# Altium schematic sheet PWR.SchDoc
size A; SheetNumber: 1; SheetTotal: 2
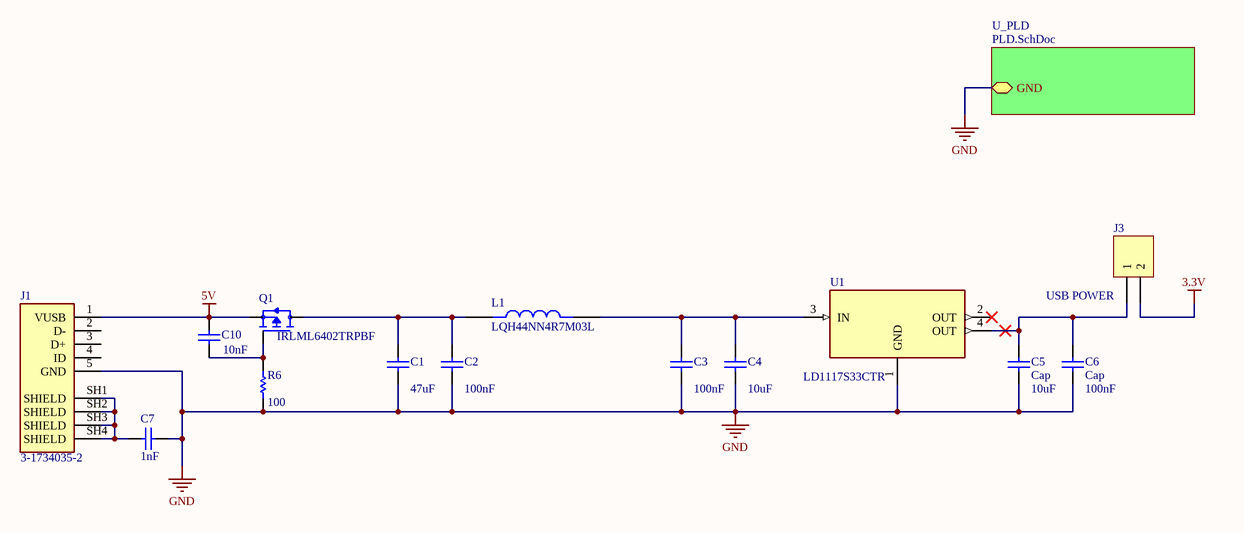
[diagram p0: PWR.SchDoc]

## Parts
C1  value 47uF  [WCAP-CSGP_885012209019]  (hidden comment: Cap)
C2  value 100nF  [WCAP-CSST_885382207009]  (hidden comment: Cap)
C3  value 100nF  [WCAP-CSST_885382207009]  (hidden comment: Cap)
C4  value 10uF  [WCAP-CSST_885382207009]  (hidden comment: Cap)
C5  Cap  value 10uF  [WCAP-CSST_885382207009]
C6  Cap  value 100nF  [WCAP-CSST_885382207009]
C7  value 1nF  [WCAP-CSST_885382207009]  (hidden comment: Cap)
C10  value 10nF  [WCAP-CSST_885382207009]  (hidden comment: Cap)
J1  3-1734035-2  [TE_3-1734035-2]
J3  USB POWER  [HDR1X2]
L1  LQH44NN4R7M03L  [IND_LQH44NN4R7M03L]
Q1  IRLML6402TRPBF  [SOT95P237X112-3N]
R6  value 100  [WCAP-CSST_885382207009]  (hidden comment: Res1)
U1  LD1117S33CTR  [SOT223]

## Sub-sheets
U_PLD = PLD.SchDoc: GND (bidir)

## Nets
3.3V: J3.2
5V: C10.2 J1.1(VUSB) Q1.2(S)
GND: C1.1 C2.1 C3.1 C4.1 C5.1 C6.1 C7.2 J1.5(GND) R6.1 U1.1(GND) ; sheet U_PLD/GND
NetC1_2: C1.2 C2.2 L1.1 Q1.3(D)
NetC3_2: C3.2 C4.2 L1.2 U1.3(IN)
NetC5_2: C5.2 C6.2 J3.1 U1.4(OUT)
NetC7_1: C7.1 J1.SH1(SHIELD) J1.SH2(SHIELD) J1.SH3(SHIELD) J1.SH4(SHIELD)
NetC10_1: C10.1 Q1.1(G) R6.2

Not connected (* = marked no-connect by the designer): J1 2(D-) 3(D+) 4(ID); U1 2(OUT)*

## Library data of the parts
C1-C7 C10 = Cap: Capacitor; Published: 8-Jun-2000; LatestRevisionDate: 17-Jul-2002; LatestRevisionNote: Re-released for DXP Platform.; PackageReference: RAD-0.3; Publisher: Altium Limited; PackageDescription: Radial Cap, Thru-Hole; 2 Leads; 0.3 in Pin Spacing
J1 = 3-1734035-2: USB Connectors MINI USB, R/A, SMT, MATTE TIN, W/O MYLAR; MF: TE Connectivity; Value: *; SnapEDA_Link: https://www.snapeda.com/parts/3-1734035-2/TE+Connectivity+AMP+Connectors/view-part/?ref=snap; Purchase-URL: https://pricing.snapeda.com/search/part/3-1734035-2/?ref=eda; Availability: In Stock; Price: None; Package: None; Check_prices: https://www.snapeda.com/parts/3-1734035-2/TE+Connectivity+AMP+Connectors/view-part/?ref=eda; MP: 3-1734035-2
J3 = Header 2: Header, 2-Pin; LatestRevisionDate: 17-Jul-2002; LatestRevisionNote: Re-released for DXP Platform.; Publisher: Altium Limited
L1 = LQH44NN4R7M03L: FIXED IND 22UH 950MA 170 MOHM; Package: None; Price: None; Value: *; MP: LQH44NN4R7M03L; Availability: Unavailable
Q1 = IRLML6402TRPBF: RoHS Compliant | Industry-leading quality | Fast Switching | Low Profile _less than 1.1mm_ | P-Channel MOSFET | SOT-23 Footprint; MF: Infineon; Package: SOT-23 Infineon; Value: *; Price: None; MP: IRLML6402TRPBF; SnapEDA_Link: https://www.snapeda.com/parts/IRLML6402TRPBF/Infineon%20Technologies/view-part/523558/?ref=snap; Availability: Unavailable
R6 = Res1: Resistor; Published: 8-Jun-2000; LatestRevisionDate: 17-Jul-2002; LatestRevisionNote: Re-released for DXP Platform.; PackageReference: AXIAL-0.3; Publisher: Altium Limited; PackageDescription: Axial Device, Thru-Hole; 2 Leads; 0.3 in Pin Spacing
U1 = LD1117S33CTR: Linear Voltage Regulator IC Positive Fixed 1 Output 800mA SOT-223; MF: STMicroelectronics; Package: SOT-223 STMicroelectronics; Purchase-URL: https://pricing.snapeda.com/search/part/LD1117S33CTR/?ref=eda; MP: LD1117S33CTR; Value: *; Availability: In Stock; SnapEDA_Link: https://www.snapeda.com/parts/LD1117S33CTR/STMicroelectronics/view-part/?ref=snap; Price: None; Check_prices: https://www.snapeda.com/parts/LD1117S33CTR/STMicroelectronics/view-part/?ref=eda